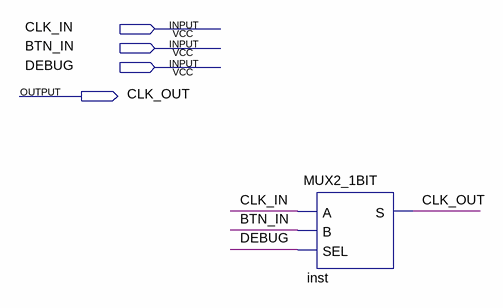
[diagram p0: schematic sheet]
// Quartus schematic RUN_STEP_MODE.bdf as structural Verilog: 1 symbols, 4 pins
module RUN_STEP_MODE (
  input  CLK_IN,
  input  BTN_IN,
  input  DEBUG,
  output CLK_OUT
);

  MUX2_1BIT inst (.A(CLK_IN), .B(BTN_IN), .SEL(DEBUG), .S(CLK_OUT));
endmodule
